# EAGLE design Awesome-Shield-1.0 (EAGLE 7.6.0)
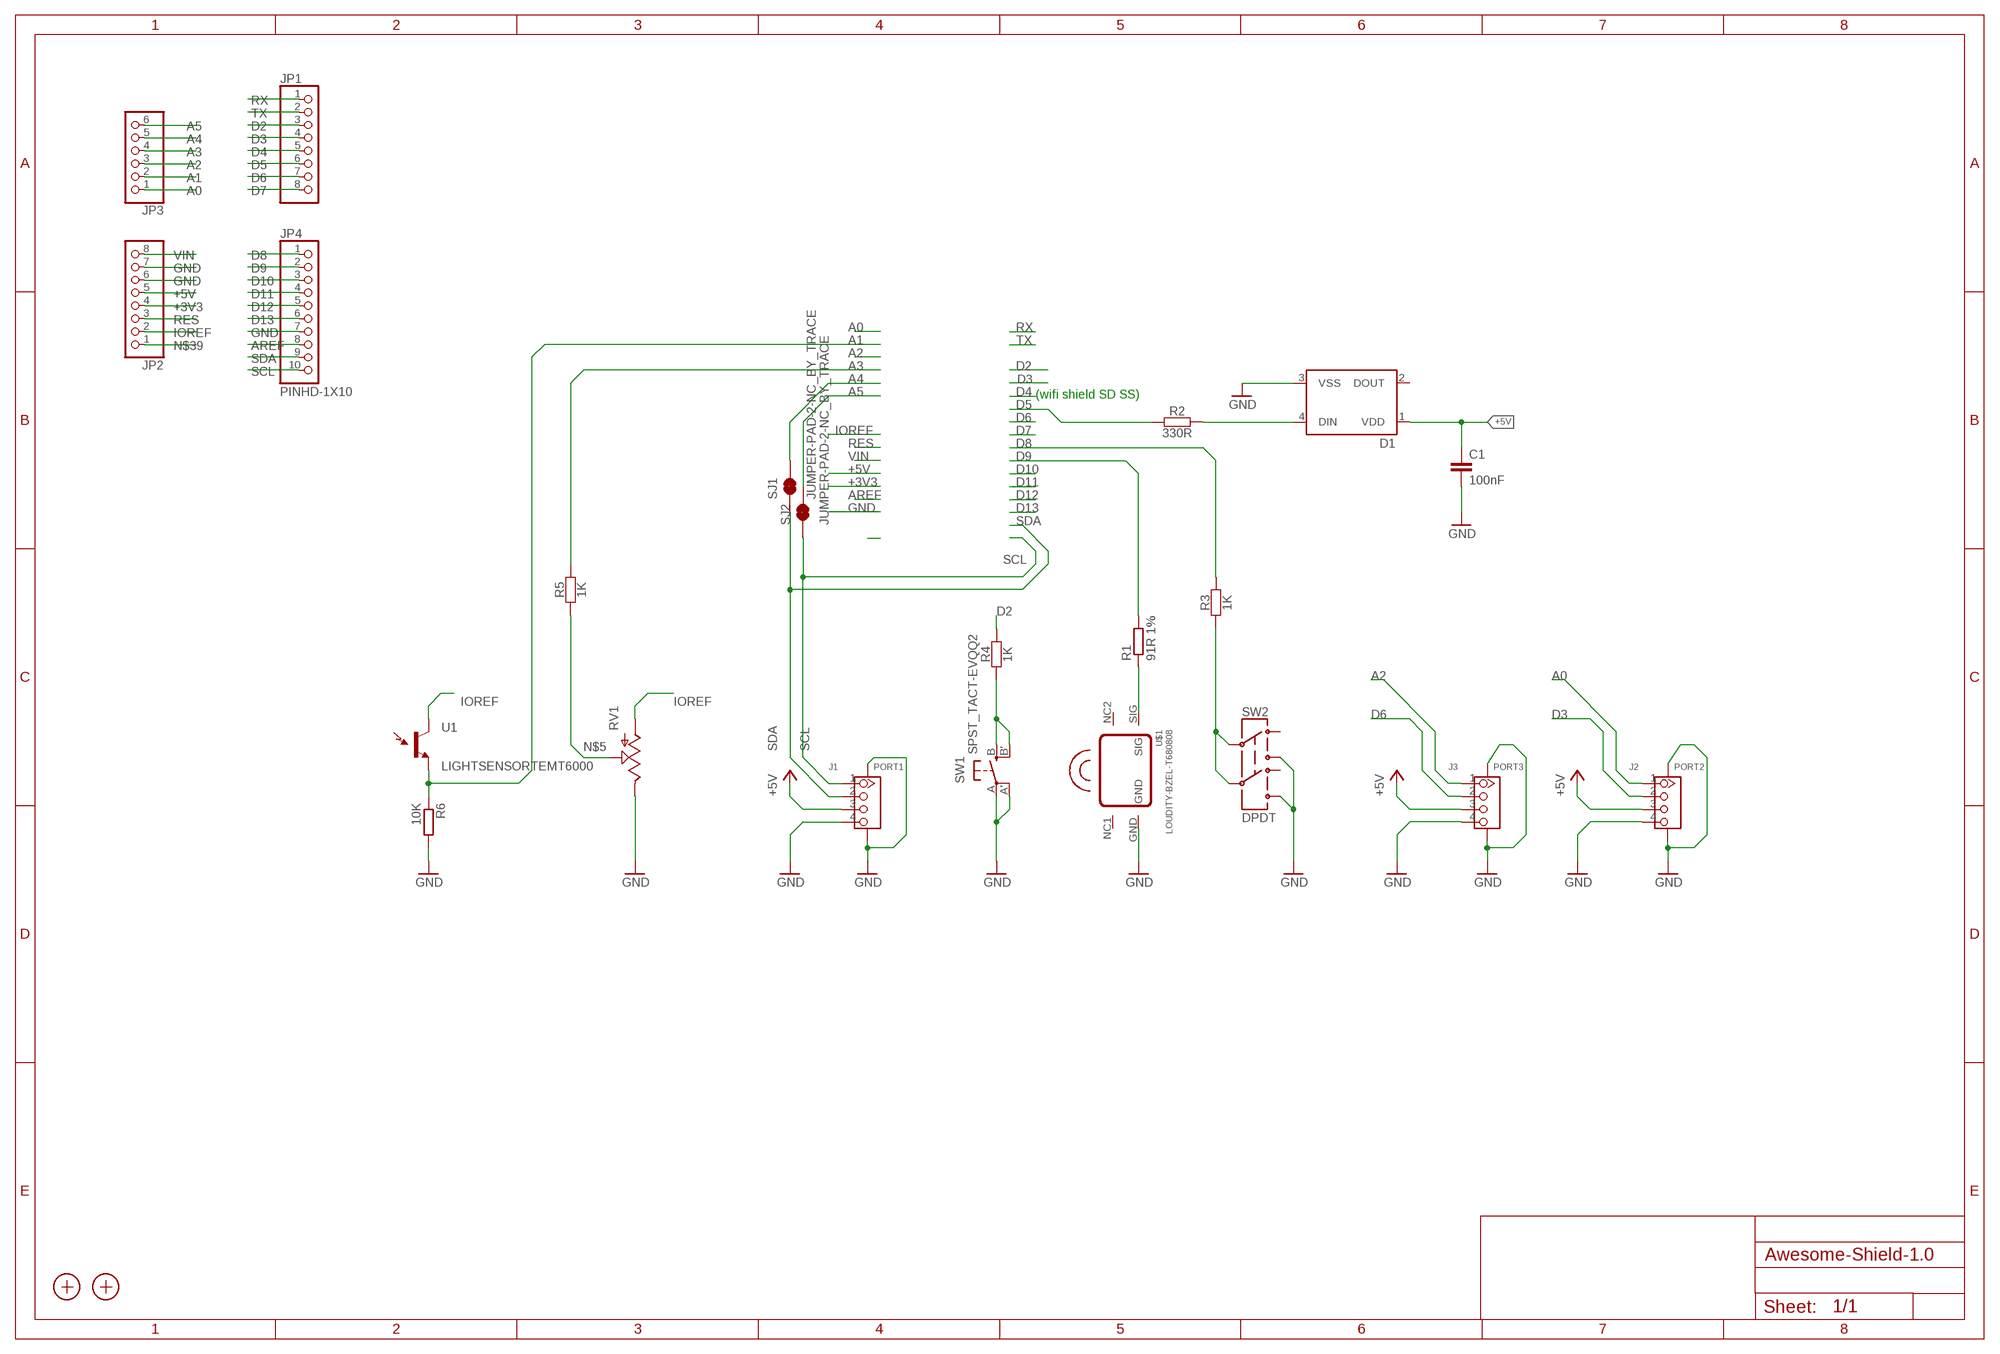
[diagram p0: schematic, sheet 1]

## Parts
C1  100nF  C-EUC0603  [C0603]
D1  WS2812B  [WS2812B]
J1  PORT1  GROVE-CONNECTOR-SMD(4+2P-2.0)  [HW4-SMD-2.0]
J2  PORT2  GROVE-CONNECTOR-SMD(4+2P-2.0)  [HW4-SMD-2.0]
J3  PORT3  GROVE-CONNECTOR-SMD(4+2P-2.0)  [HW4-SMD-2.0]
JP1  PINHD-1X8CLEANBIG  [1X08-CLEANBIG]
JP2  PINHD-1X8CLEANBIG  [1X08-CLEANBIG]
JP3  PINHD-1X6CLEAN  [1X06-CLEAN]
JP4  PINHD-1X10  [1X10-BIG]
R1  91R 1%  R-EU_R1206  [R1206]
R2  330R  RESISTOR-1206  [C1206]
R3  1K  RESISTOR-0603  [C0603]
R4  1K  RESISTOR-0603  [C0603]
R5  1K  RESISTOR-0603  [C0603]
R6  10K  R-EU_R1206  [R1206]
RV1  POT  [ALPS_POT]
SJ1  JUMPER-PAD-2-NC_BY_TRACE  [PAD-JUMPER-2-NC_BY_TRACE_YES_SILK]
SJ2  JUMPER-PAD-2-NC_BY_TRACE  [PAD-JUMPER-2-NC_BY_TRACE_YES_SILK]
SW1  SPST_TACT-EVQQ2  [EVQ-Q2]
SW2  DPDT  SWITCH-DPDTAYZ0202  [AYZ0202]
U1  LIGHTSENSORTEMT6000  [TEMT6000-SEN]
U$1  LOUDITY-BZEL-T680808  [SMT-68]
X1  PASSER-07  [PASSER_07MM]
X2  PASSER-07  [PASSER_07MM]

## Nets
+3V3: JP2.4
+5V: C1.1 D1.1(VDD) J1.3 J2.3 J3.3 JP2.5
A0: J2.1 JP3.1
A1: JP3.2 R6.1 U1.EMITTER(E1)
A2: J3.1 JP3.3
A3: JP3.4 R5.2
A4: JP3.5 SJ1.2
A5: JP3.6 SJ2.2
AREF: JP4.8
D2: JP1.3 R4.2
D3: J2.2 JP1.4
D4: JP1.5
D5: JP1.6 R2.1
D6: J3.2 JP1.7
D7: JP1.8
D8: JP4.1 R3.2
D9: JP4.2 R1.2
D10: JP4.3
D11: JP4.4
D12: JP4.5
D13: JP4.6
GND: C1.2 D1.3(VSS) J1.4 J1.SS1 J1.SS2 J2.4 J2.SS1 J2.SS2 J3.4 J3.SS1 J3.SS2 JP2.6 JP2.7 JP4.7 R6.2 RV1.P$1(E) SW1.A'(P1) SW1.A(P) SW2.3 SW2.6 U$1.GND
IOREF: JP2.2 RV1.P$3(A) U1.COLLECTOR(C1)
N$2: R1.1 U$1.SIG
N$3: D1.4(DIN) R2.2
N$4: R3.1 SW2.2 SW2.5
N$5: R5.1 RV1.P$2(S)
N$6: R4.1 SW1.B'(S1) SW1.B(S)
N$39: JP2.1
RES: JP2.3
RX: JP1.1
SCL: J1.1 JP4.10 SJ2.1
SDA: J1.2 JP4.9 SJ1.1
TX: JP1.2
VIN: JP2.8
Unconnected: D1.2(DOUT) SW2.1 SW2.4 U$1.NC1(NC) U$1.NC2(NC)

## Notes on the sheet
- Power for the LED can be 3V3 ... 5V, forward voltage of
  blue and green emitters might be slightly above 3V3, so for
  full brightness the nominal current might not be reached
  with 3V3 for blue and green -> color temperature for
  full white is warm
- (wifi shield SD SS)
- GROVE PORT1 | GROVE PORT2 | GROVE PORT3

## Library data of the parts
C1 = rcl:C-EU: CAPACITOR, European symbol
D1 = SparkFun-LED:WS2812B: WS2812B - Intelligent control LED integrated light source Technical Specifications: Power Supply Voltage (VDD): 3.5 to 5.3 V Input Voltage (VI): -0.5 to VDD+0.5 V Operating Junction Temperature (Topt): -25°C to +80°C Storage Temperature Range (Tstg): -55°C to +150°C; PROD_ID: DIO-12503
J1-J3 = Seeed-OPL-Connector:GROVE-CONNECTOR-SMD(4+2P-2.0): 320110030
JP1 JP2 = adafruit:PINHD-1X8: PIN HEADER
JP3 = adafruit:PINHD-1X6: PIN HEADER
JP4 = adafruit:PINHD-1X10: Pin header 1x10 0.1" spacing With round pins
R1 R6 = rcl:R-EU_: RESISTOR, European symbol
R2-R5 = we-rcl:RESISTOR: Resistors all kinds in 0402 and 0603
RV1 = SparkFun-Electromechanical:POT; PROD_ID: RES-09177
SJ1 SJ2 = SparkFun-Passives:JUMPER-PAD-2-NC_BY_TRACE
SW1 = adafruit:SPST_TACT: SMT 6mm switch, EVQQ2 series http://www.ladyada.net/library/eagle
SW2 = SparkFun-Electromechanical:SWITCH-DPDT: DPDT Version of the COM-00597; PROD_ID: SWCH-08179
U1 = SparkFun-Sensors:LIGHTSENSOR: Ambient Light Sensor Simple light detection sensor. Output varies with light intensity input. Spark Fun Electronics SKU : COM-08348
U$1 = buzzer-loudity-bzel-t68-0808:LOUDITY-BZEL-T68
X1 X2 = we-symbol:PASSER: Fiducial Markers

## Net classes
0 default: width 0.203 mm, drill 0.305 mm, clearance 0.152 mm

## Board
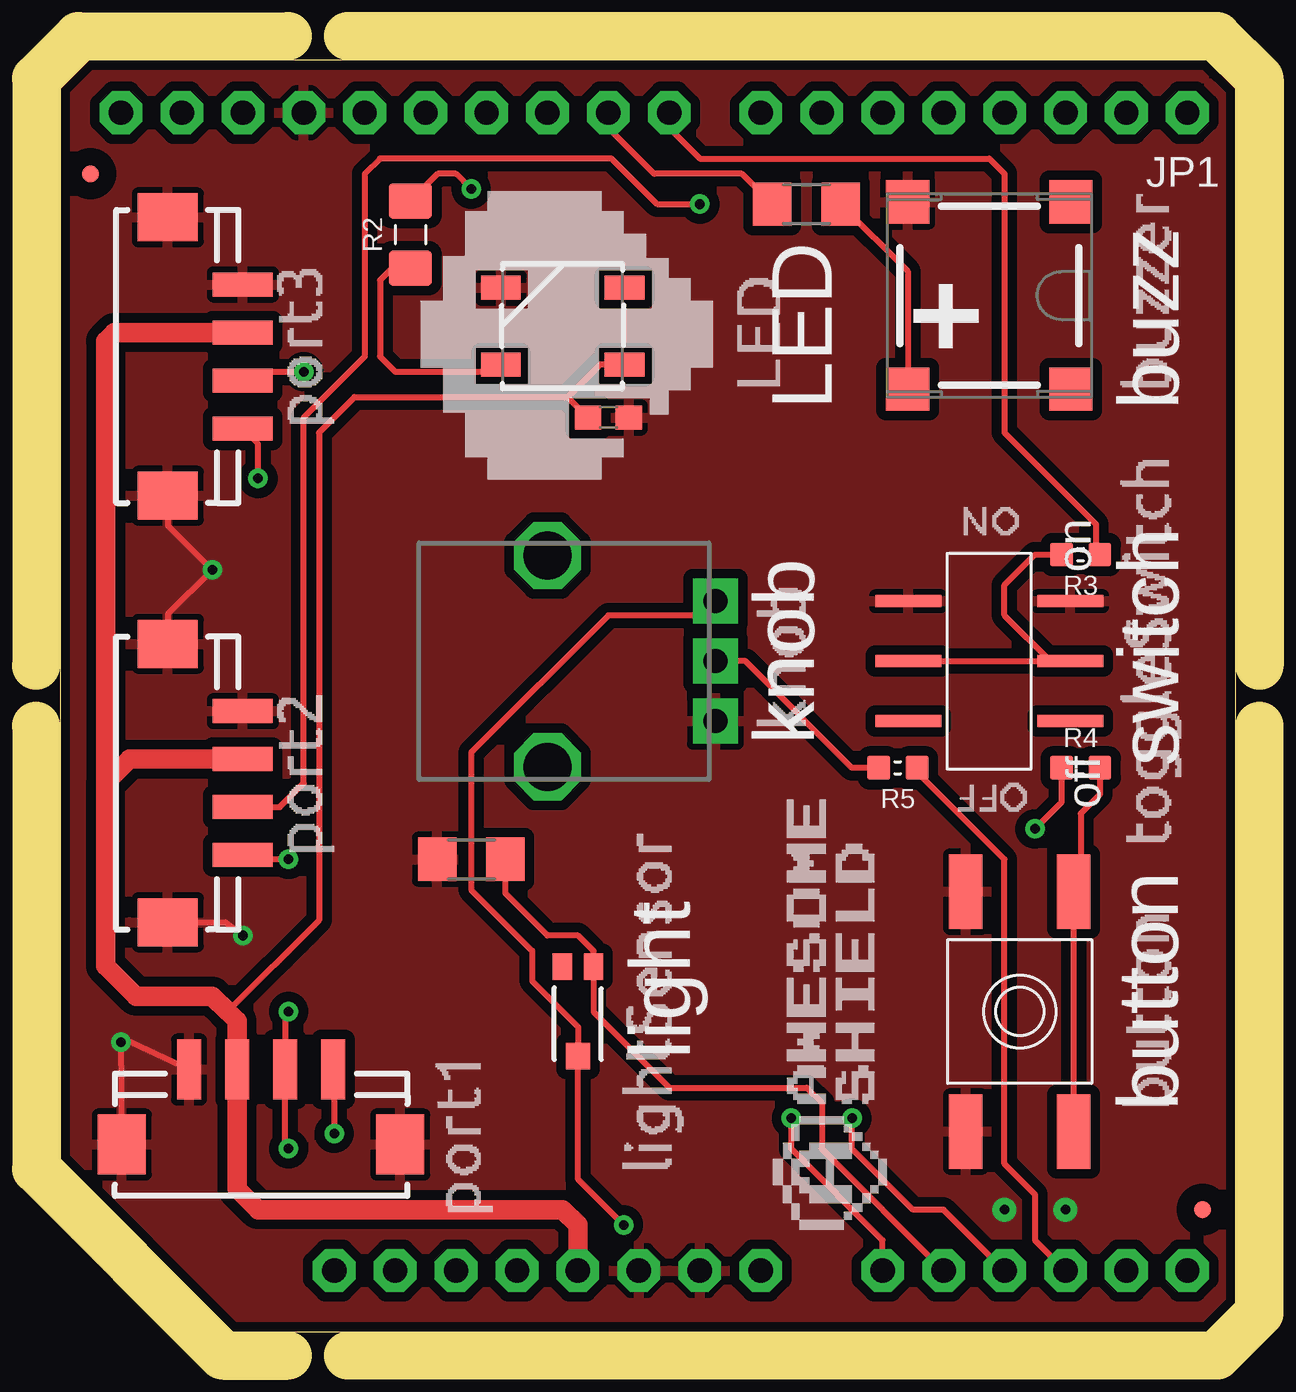
[diagram p1: board, top side]
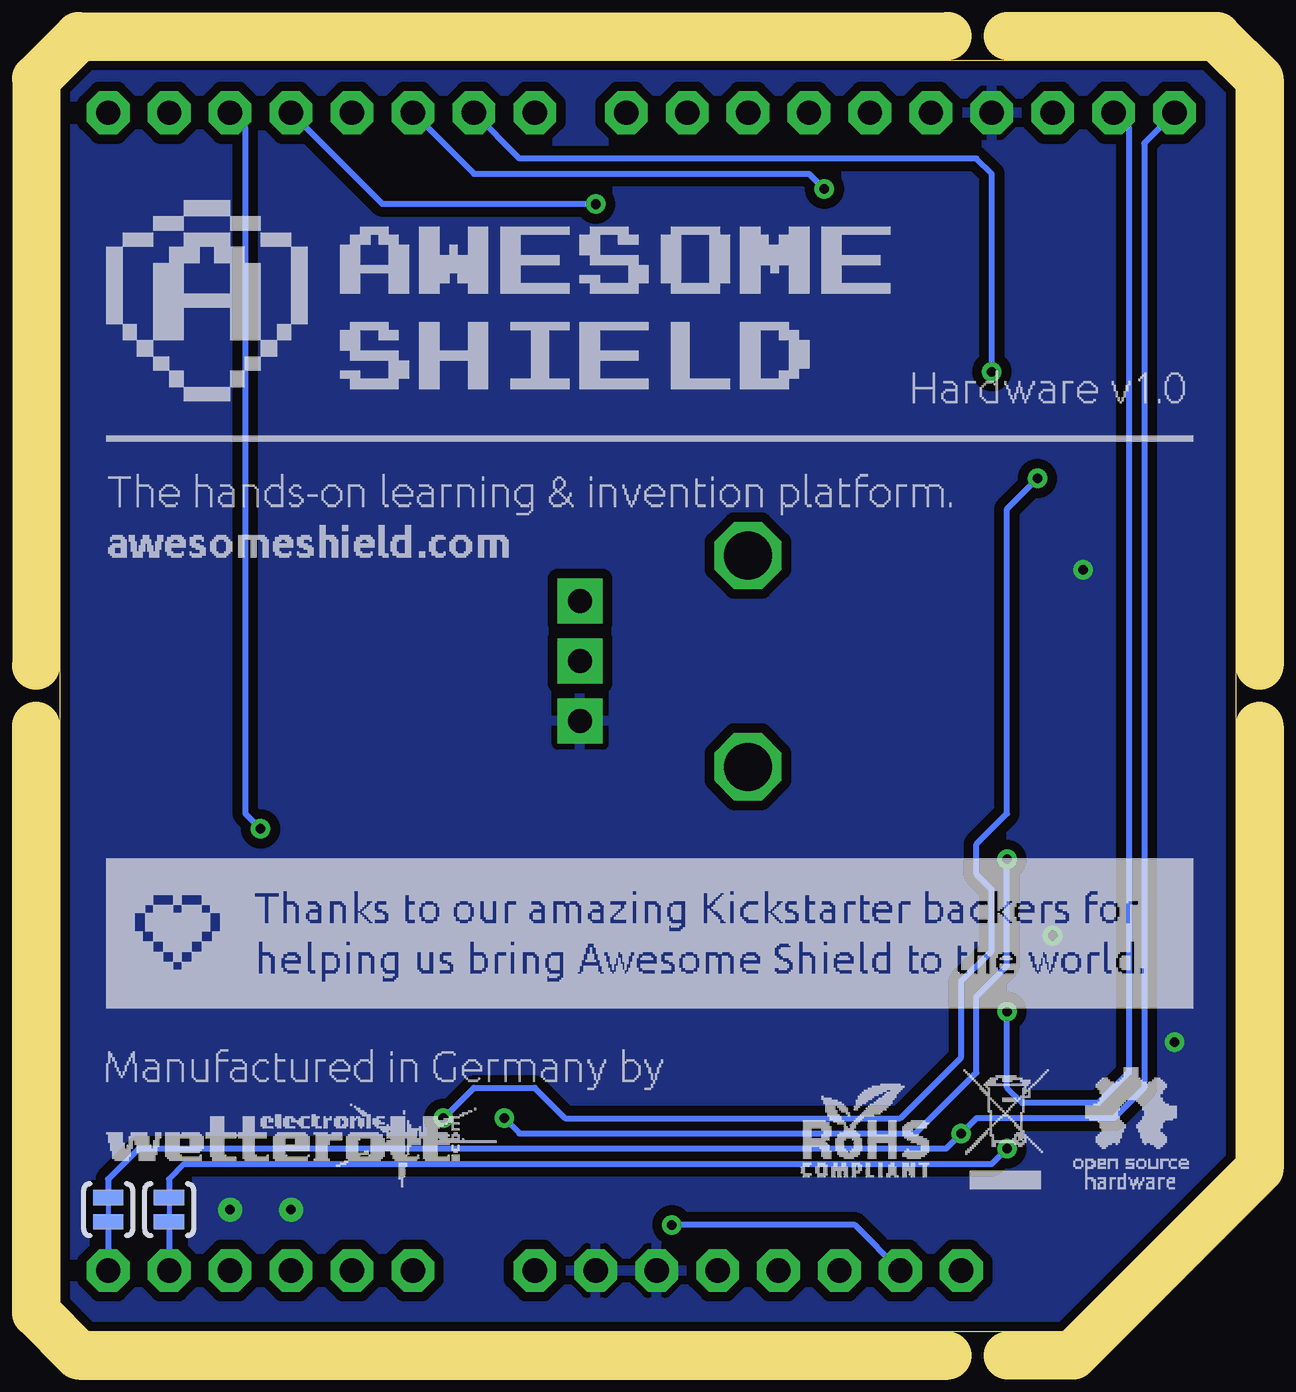
[diagram p2: board, bottom side, seen from below]

Size 49 x 53 mm. Coordinates in mm from the lower left corner, seen from the top.
Outline: 1.2,53 0,51.8 0,7.2 7.2,0 47.8,0 49,1.2 49,51.8 47.8,53 1.2,53
Copper layers (1*16): Top 0.035mm / dielectric 1.5mm / Bottom 0.035mm
Design rules "we-dru-2-layer *": minimum track width 0.15mm, minimum drill 0.3mm, track to track 0.15mm, track to pad 0.15mm, pad to pad 0.15mm, via to via 0.15mm, smd to smd 0.1mm, copper to edge 0.4mm, drill to drill 0.2mm, minimum pad ring 0.18mm, minimum via ring 0.2mm, stop-mask expansion 0.1mm, vias tented up to drill 0.75mm, thermal gap 0.25mm
Milling: 12 lines

### Footprints (pad centres in the part's own frame; a part is rotated, then mirrored left to right if it is on the bottom)
C0603 = smd 1.1 x 1: 1 -0.85,0; 2 0.85,0
WS2812B = smd 1.651 x 1: 1 -2.577,1.6; 2 -2.577,-1.6; 3 2.577,-1.6; 4 2.577,1.6
HW4-SMD-2.0 = smd 1 x 2.5: 1 -3,0; 2 -1,0; 3 1,0; 4 3,0 | smd 2 x 2.5: SS1 -5.8,3.123; SS2 5.8,3.123
1X08-CLEANBIG = drill 1.016 pad 1.778 octagon: 1 -8.89,0; 2 -6.35,0; 3 -3.81,0; 4 -1.27,0; 5 1.27,0; 6 3.81,0; 7 6.35,0; 8 8.89,0
1X06-CLEAN = drill 1.016 pad 1.778 octagon: 1 -6.35,0; 2 -3.81,0; 3 -1.27,0; 4 1.27,0; 5 3.81,0; 6 6.35,0
1X10-BIG = drill 1.016 pad 1.778 octagon: 1 -11.43,0; 2 -8.89,0; 3 -6.35,0; 4 -3.81,0; 5 -1.27,0; 6 1.27,0; 7 3.81,0; 8 6.35,0; 9 8.89,0; 10 11.43,0
R1206 = smd 1.6 x 1.803: 1 -1.422,0; 2 1.422,0
C1206 = smd 1.8 x 1.45: 1 0,1.4; 2 0,-1.4
C0603' = smd 1 x 0.95: 1 0,0.8; 2 0,-0.8
ALPS_POT = drill 1 pad 1.88 square: P$1 7,-2.5; P$2 7,0; P$3 7,2.5 | drill 2 octagon: P$4 0,-4.4; P$5 0,4.4
PAD-JUMPER-2-NC_BY_TRACE_YES_SILK = smd 0.635 x 1.27: 1 -0.508,0; 2 0.508,0
EVQ-Q2 = smd 3.1 x 1.4: A -5,-2.25; A' 5,-2.25; B -5,2.25; B' 5,2.25
AYZ0202 = smd 0.5 x 2.75: 1 -2.5,3.375; 2 0,3.375; 3 2.5,3.375; 4 -2.5,-3.375; 5 0,-3.375; 6 2.5,-3.375
TEMT6000-SEN = smd 1.1 x 0.8: BASE -1.87,-0.65; EMITTER -1.87,0.65 | smd 1.1 x 1: COLLECTOR 1.86,0.01
SMT-68 = smd 1.8 x 1.8: GND 3.9,3.4; NC1 3.9,-3.4; NC2 -3.9,-3.4; SIG -3.9,3.4
PASSER_07MM = smd 0.7 x 0.7: X 0,0

### Placement (x,y rotation side)
C1  22.86,38.1 0 top
D1  20.95,41.91 180 top
J1  8.38,10.92 180 top
J2  7.62,22.86 90 top
J3  7.62,40.64 90 top
JP1  38.1,50.8 180 top
JP2  20.32,2.54 0 top
JP3  40.64,2.54 0 top
JP4  13.97,50.8 180 top
R1  31.11,46.99 180 top
R2  14.61,45.72 0 top
R3  1K  [C0603']  42.55,32.38 90 top
R4  1K  [C0603']  42.55,23.5 270 top
R5  1K  [C0603']  34.92,23.5 90 top
R6  17.14,19.68 180 top
RV1  20.32,27.94 0 top
SJ1  44.45,5.08 270 bottom
SJ2  46.99,5.08 270 bottom
SW1  40.01,13.34 270 top
SW2  38.73,27.94 90 top
U1  21.59,13.34 270 top
U$1  38.73,43.18 90 top
X1  1.27,48.26 0 top
X2  47.62,5.08 0 top

### Tracks (layer width: path | path; a pad name or v marks a point on that pad's centre or on a via)
+5V
  Top 0.254: J3.3 7.99,41.27 | 6.99,13.34 10.79,17.14 10.79,37.47 12.28,38.95 21.16,38.95 | 21.16,38.95 C1.1 | D1.1 22.52,40.31 21.16,38.95
  Top 0.813: JP2.5 21.59,4.45 20.95,5.08 8.26,5.08 7.38,5.95 J1.3 7.38,12.94 6.99,13.34 6.35,13.97 3.17,13.97 1.91,15.24 1.91,22.86 | 1.91,22.86 2.9,23.86 J2.3 | J3.3 2.27,41.64 1.91,41.27 1.91,22.86
A0  (via drill 0.4 pad 0.81)
  Top 0.254: v9.53,19.68 7.45,19.68 J2.1 | JP3.1 34.29,3.81 30.48,7.62 v30.48,8.89
  Bottom 0.254: v30.48,8.89 29.84,8.26 13.34,8.26 10.79,10.79 10.79,13.97 9.53,15.24 v9.53,19.68
A1
  Top 0.254: 18.57,18.9 R6.1 18.57,18.26 20.32,16.51 21.59,16.51 22.24,15.86 U1.EMITTER 22.24,13.32 25.4,10.16 31.11,10.16 31.75,9.53 31.75,7.62 JP3.2
A2  (via drill 0.4 pad 0.81)
  Top 0.254: v8.26,35.56 8.26,37.01 J3.1 | JP3.3 36.83,5.08 35.56,5.08 33.02,7.62 v33.02,8.89
  Bottom 0.254: v33.02,8.89 31.75,10.16 29.21,10.16 27.94,8.89 13.97,8.89 11.43,11.43 11.43,14.61 10.16,15.88 10.16,18.41 10.79,19.05 10.79,20.32 9.53,21.59 9.53,34.29 v8.26,35.56
A3
  Top 0.254: JP3.4 40.64,3.81 40.64,5.71 39.37,6.99 39.37,19.68 35.73,23.33 R5.2
A4
  Bottom 0.254: SJ1.2 JP3.5
A5
  Bottom 0.254: SJ2.2 JP3.6
D2  (via drill 0.4 pad 0.81)
  Top 0.254: R4.2 41.74,22.06 v40.64,20.95
  Bottom 0.254: JP1.3 41.27,50.16 41.27,21.59 v40.64,20.95
D3  (via drill 0.4 pad 0.81)
  Top 0.254: J2.2 9.16,21.86 10.16,22.86 10.16,38.1 12.7,40.64 12.7,48.26 13.34,48.9 22.99,48.9 24.89,46.99 v26.67,46.99
  Bottom 0.254: v26.67,46.99 35.56,46.99 JP1.4
D5  (via drill 0.4 pad 0.81)
  Top 0.254: v17.14,47.62 16.51,48.26 15.74,48.26 R2.1
  Bottom 0.254: JP1.6 31.75,48.26 17.78,48.26 v17.14,47.62
D6  (via drill 0.4 pad 0.81)
  Top 0.254: J3.2 7.99,40.01 v10.16,40.01
  Bottom 0.254: v10.16,40.01 10.16,48.26 10.79,48.9 29.84,48.9 JP1.7
D8
  Top 0.254: JP4.1 25.4,50.16 26.67,48.9 38.73,48.9 39.37,48.26 39.37,37.47 43.18,33.66 43.18,32.55 R3.2
D9
  Top 0.254: R1.2 28.42,48.26 24.77,48.26 22.86,50.16 JP4.2
GND  (via drill 0.4 pad 0.81, 0.4 pad 1)
  Top 0.254: J2.SS1 6.9,17.06 v7.62,16.51 | J1.SS2 2.58,10.75 v2.54,12.06 2.67,12.19 J1.4 | J3.SS1 4.5,33.6 v6.35,31.75 4.5,29.9 J2.SS2
  other vias: 41.91,5.08 39.37,5.08
  pour Top (isolate 0.406): 47.8,53.1 1.2,53 0,51.8 0,7.2 7.1,0 47.8,0 49,1.3 49.06,4.9 49.06,37.9 49,40.5 49,51.9
  pour Bottom (isolate 0.406): 1.2,53 0,51.8 0,7.2 7.2,0 47.8,0 49.1,1.4 49.06,3.88 49.06,36.88 49,41 49,51.9 47.8,53.1
IOREF  (via drill 0.4 pad 0.81)
  Top 0.254: RV1.P$3 26.73,29.84 22.86,29.84 17.14,24.13 17.14,18.41 19.68,15.88 19.68,14.61 21.6,12.69 U1.COLLECTOR 21.6,6.34 v23.5,4.45
  Bottom 0.254: JP2.2 15.88,4.45 v23.5,4.45
N$2
  Top 0.254: 35.02,39.28 U$1.SIG 35.34,44.19 R1.1
N$3
  Top 0.254: D1.4 18.07,40.01 13.97,40.01 13.34,40.64 13.34,43.81 13.84,44.32 R2.2
N$4
  Top 0.254: SW2.2 SW2.5 41.27,27.94 39.37,29.84 39.37,31.11 40.64,32.38 R3.1
N$5
  Top 0.254: R5.1 33.02,23.5 28.57,27.94 RV1.P$2
N$6
  Top 0.254: SW1.B' SW1.B 42.55,18.62 42.55,21.59 43.34,22.39 R4.1
SCL  (via drill 0.4 pad 0.81)
  Top 0.254: J1.1 11.43,10.97 v11.43,8.26
  Bottom 0.254: JP4.10 3.81,49.53 3.81,10.16 5.08,8.89 10.79,8.89 v11.43,8.26 12.06,7.62 45.72,7.62 46.99,6.35 SJ2.1
SDA  (via drill 0.4 pad 0.81)
  Top 0.254: v9.53,7.62 9.38,7.76 J1.2 9.38,13.19 v9.53,13.34
  Bottom 0.254: v9.53,7.62 10.16,6.99 43.81,6.99 44.45,6.35 SJ1.1 | JP4.9 4.45,50.16 4.45,10.79 5.71,9.53 8.89,9.53 9.53,10.16 v9.53,13.34

### Text on the board
tNames: LED | buzz | knob | on | switch | off | light | button